# Altium schematic sheet Signal_Conditioning_1.SchDoc
size A4; CompanyName: Technische Hochschule Nürnberg Georg Simon Ohm; Address1: Fürther Straße 250; Address2: 90429 Nürnberg; Address3: GERMANY; SheetNumber: 4; SheetTotal: 5; CompanyName2: Institut ELSYS
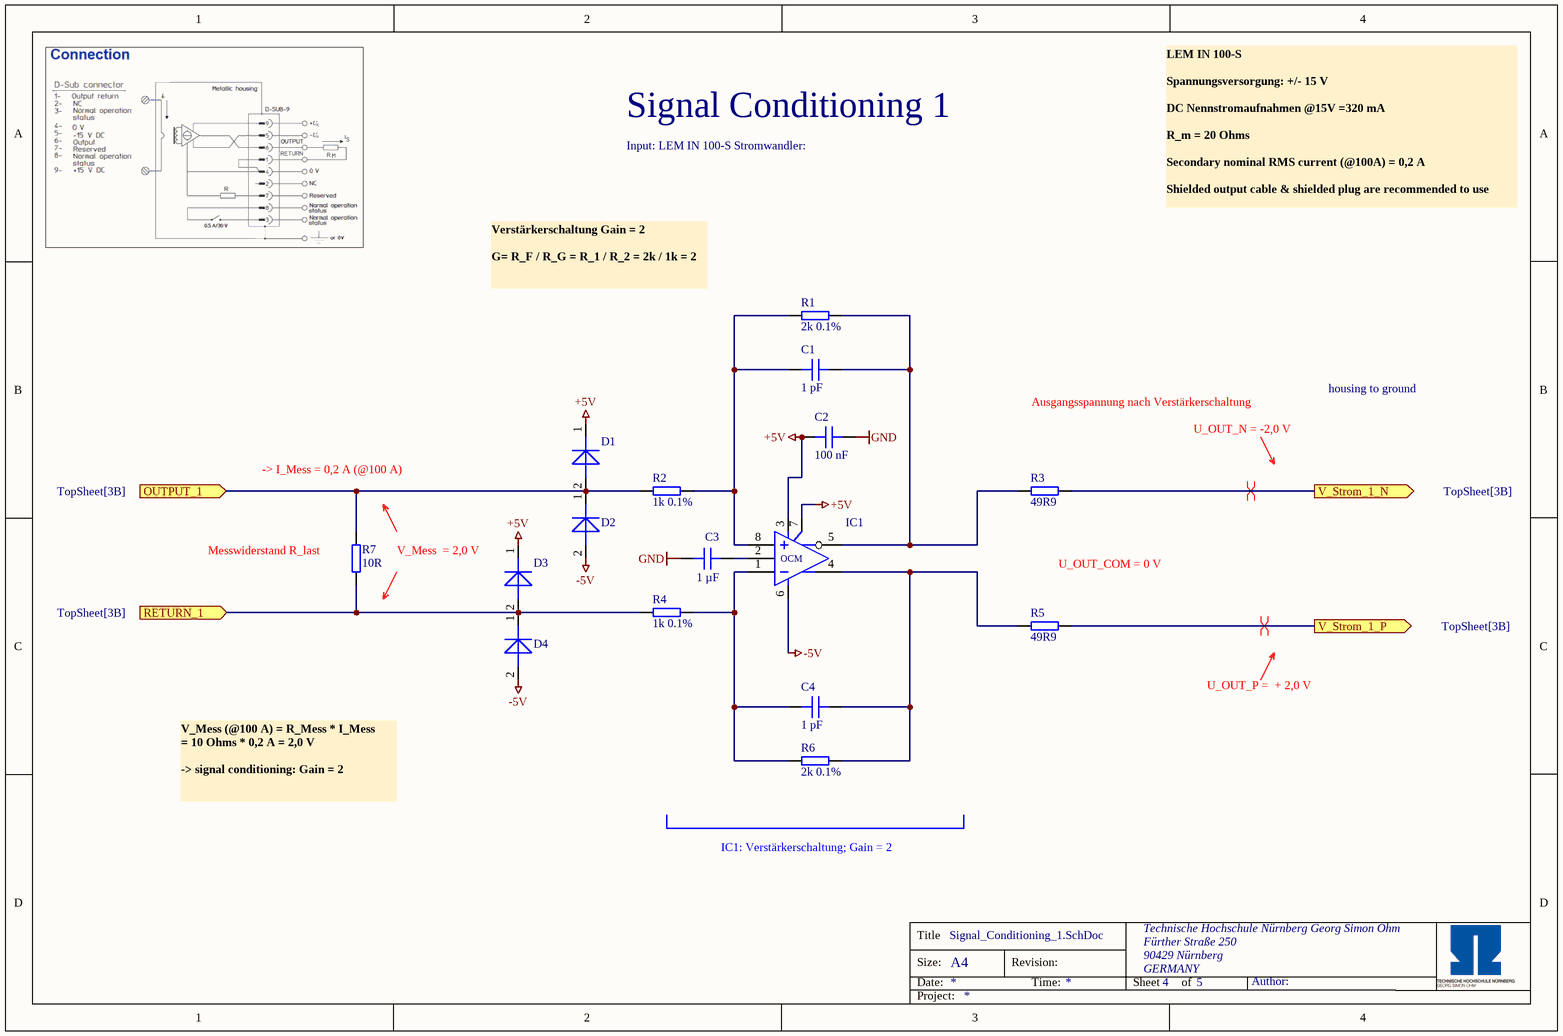
[diagram p0: Signal_Conditioning_1.SchDoc]

## Parts
C1  1 pF  [C_0603]
C2  100 nF  [C_0603]
C3  1 µF  [C_0603]
C4  1 pF  [C_0603]
D1  1SS356VMFHTE-17  [1SS356VMFHTE17]  (value not drawn)
D2  1SS356VMFHTE-17  [1SS356VMFHTE17]  (value not drawn)
D3  1SS356VMFHTE-17  [1SS356VMFHTE17]  (value not drawn)
D4  1SS356VMFHTE-17  [1SS356VMFHTE17]  (value not drawn)
IC1  ADA4940-1ARZ-R7  [SOIC-8-N]  (value not drawn)
R1  2k 0.1%  [RES 1206_3216]
R2  1k 0.1%  [RES 1206_3216]
R3  49R9  [RES 0603_1608]
R4  1k 0.1%  [RES 1206_3216]
R5  49R9  [RES 0603_1608]
R6  2k 0.1%  [RES 1206_3216]
R7  10R  [RES 1206_3216]

## Ports
OUTPUT_1 (in, see TopSheet[3B]), RETURN_1 (in, see TopSheet[3B]), V_Strom_1_N (out, see TopSheet[3B]), V_Strom_1_P (out, see TopSheet[3B])

## Nets
+5V: C2.1 D1.1(K) D3.1(K) IC1.3(V+) IC1.7(EN)
-5V: D2.2(A) D4.2(A) IC1.6(V-)
GND: C2.2 C3.1
OUTPUT_1: D1.2(A) D2.1(K) R2.1 R7.2 ; port OUTPUT_1
RETURN_1: D3.2(A) D4.1(K) R4.1 R7.1 ; port RETURN_1
V_Strom_1_N: R3.2 ; port V_Strom_1_N
V_Strom_1_P: R5.2 ; port V_Strom_1_P
NetC1_1: C1.1 IC1.8(+) R1.1 R2.2
NetC1_2: C1.2 IC1.5(Out) R1.2 R3.1
NetC3_2: C3.2 IC1.2(OCM)
NetC4_1: C4.1 IC1.1(-) R4.2 R6.1
NetC4_2: C4.2 IC1.4(Out) R5.1 R6.2

## Layout directives
differential pair: V_Strom_1_N, V_Strom_1_P

## Notes on the sheet
- Signal Conditioning 1
- Input: LEM IN 100-S Stromwandler:
- LEM IN 100-S
  Spannungsversorgung: +/- 15 V
  DC Nennstromaufnahmen @15V =320 mA
  R_m = 20 Ohms
  Secondary nominal RMS current (@100A) = 0,2 A
  Shielded output cable & shielded plug are recommended to use
- Verstärkerschaltung Gain = 2
  G= R_F / R_G = R_1 / R_2 = 2k / 1k = 2
- Ausgangsspannung nach Verstärkerschaltung
- U_OUT_N = -2,0 V
- housing to ground
- -> I_Mess = 0,2 A (@100 A)
- (near R7) Messwiderstand R_last
- V_Mess  = 2,0 V
- U_OUT_COM = 0 V
- U_OUT_P =  + 2,0 V
- V_Mess (@100 A) = R_Mess * I_Mess
  = 10 Ohms * 0,2 A = 2,0 V
  -> signal conditioning: Gain = 2
- IC1: Verstärkerschaltung; Gain = 2
- Title
- Size:
- Date:
- A4
- Revision:
- Time:
- Sheet
- of
- Author:
- Project:

## Library data of the parts
C1 C4 = KGM15ACG1H1R0BT: Multilayer Ceramic Capacitors MLCC - SMD/SMT 50V 1pF C0G 0603 +/-.1pF; Manufacturer: KYOCERA AVX; Tolerance: 10%; Voltage Rating: 50 VDC; Created from: TGaupp; Manufacturer Part Number: KGM15ACG1H1R0BT; PartID: 147; Created On: 13.02.2024 08:51:22; ComponentLink1Description: Datasheet; ComponentLink1URL: https://www.mouser.de/datasheet/2/40/C0GNP0_KGM-3216332.pdf; Component Type: Capacitor 0603; Device Package: 0603; Last Updated: 13.02.2024 08:51:22; Mounting Type: SMD; Operating Temperature: -55 to +125°C; Series: C0G; Supplier 1: Mouser; Supplier Part Number 1: 581-KGM15ACG1H1R0BT; Type: Capacitor; Value: 1 pF; Live Cycle Status: 1
C2 = C0603C104K9PACTU: Capacitor 0603, 6.3 VDC, 100 nF, X5R; Manufacturer: KEMET; Tolerance: 10 %; Voltage Rating: 6.3 VDC; Created from: MGremer; Manufacturer Part Number: C0603C104K9PACTU; PartID: 70; Created On: 20.12.2020 13:54:13; ComponentLink1Description: Datasheet; ComponentLink1URL: https://www.mouser.de/datasheet/2/212/KEM_C1006_X5R_SMD-1103249.pdf; Component Type: Capacitor 0603; Device Package: 0603; Last Updated: 20.01.2021 13:57:36; Mounting Type: SMD; Operating Temperature: -55 - 85°C; Series: SMD Comm X5R; Supplier 1: Mouser; Supplier Part Number 1: 80-C0603C104K9P; Type: Capacitor; Value: 100 nF; Live Cycle Status: 1; Stock number: not stored
C3 = CL10A105KB8NNNC: 50V 1uF X5R ±10% 0603  Multilayer Ceramic Capacitors MLCC - SMD/SMT ROHS; Manufacturer: Samsung Electro-Mechanics; Voltage Rating: 50 VDC; Created from: MGremer; Supplier 1: LCSC; Supplier Part Number 1: C15849; Manufacturer Part Number: CL10A105KB8NNNC; Value: 1 µF; PartID: 5; Created On: 20.12.2020 13:54:13; ComponentLink1Description: Datasheet; ComponentLink1URL: https://datasheet.lcsc.com/lcsc/1810261812_Samsung-Electro-Mechanics-CL10A105KB8NNNC_C15849.pdf; Component Type: Capacitor 0603; Device Package: 0603; Last Updated: 28.11.2022 17:23:01; Mounting Type: SMD; Operating Temperature: -55 - 85°C; Series: M; Type: Capacitor; Tolerance: 10 %; Live Cycle Status: 1; LCSC Part Number: C15849; Stock number: Labor SMD Container
D1-D4 = 1SS356VMFHTE-17: Diode; Manufacturer_Name: ROHM Semiconductor; Datasheet Link: https://fscdn.rohm.com/en/products/databook/datasheet/discrete/diode/switching/1ss355vmfhte-17-e.pdf; Height: 0.9mm; Manufacturer_Part_Number: 1SS356VMFHTE-17; Mouser Part Number: 755-1SS356VMFHTE-17; Mouser Price/Stock: https://www.mouser.co.uk/ProductDetail/ROHM-Semiconductor/1SS356VMFHTE-17?qs=doiCPypUmgG12xHjyvfQdg%3D%3D; Supplier 1: Mouser; Supplier Part Number 1: 755-1SS356VMFHTE-17
IC1 = ADA4940-1ARZ-R7: Differential ADC Driver; Manufacturer: Analog Devices; Class I: Analog; Class II: Fully Differential ADC Drivers (-40-125°C); Best.-Nr.: Farnell 209-6178; Channels: 1; Created from: MGremer; Datasheet: DSO11449, Ver. Aug 2000; Last edited: 04.01.2007 10:14; Package Reference: SOIC-N-8; Manufacturer Part Number: ADA4940-1ARZ-R7; PartID: 3; Created On: 15.01.2021 12:16:53; ComponentLink1Description: Datasheet; ComponentLink1URL: https://www.mouser.de/datasheet/2/609/ADA4940-1_4940-2-878284.pdf; Component Type: ADC; Device Package: SOIC-8; Last Updated: 22.11.2021 15:19:18; Mounting Type: SMD; Operating Temperature: -40 - 105 °C; Supplier 1: Mouser; Supplier Part Number 1: 584-ADA4940-1ARZ-R7; Type: ADC; Resolution: -; Value: differential ADC driver; Live Cycle Status: 1; Stock number: not stored
R1 R6 = TNPW12062K00BEEA: SMD resistor 2Kohms .1% 400mW 25ppm; Manufacturer: Vishay; Created from: TGaupp; Manufacturer Part Number: TNPW12062K00BEEA; PartID: 323; Created On: 12.02.2024 09:48:36; ComponentLink1Description: Datasheet; ComponentLink1URL: https://www.vishay.com/docs/28758/tnpw_e3.pdf; Component Type: SMD resistor; Device Package: 1206; Last Updated: 12.02.2024 09:48:36; Mounting Type: SMD; Supplier 1: Mouser; Supplier Part Number 1: 71-TNPW12062K00BEEA; Type: Resistor; Tolerance: 0.1%; Value: 2k; Live Cycle Status: 1; Stock number: not stored
R2 R4 = ERA-8AEB102V: SMD resistor 1/4W 1.0Kohm 0.1% 25ppm; Manufacturer: Panasonic; Created from: TGaupp; Manufacturer Part Number: ERA-8AEB102V; PartID: 292; Created On: 08.08.2023 13:03:51; ComponentLink1Description: Datasheet; ComponentLink1URL: https://www.mouser.de/datasheet/2/315/AOA0000C307-1149632.pdf; Component Type: SMD resistor; Device Package: 1206; Last Updated: 08.08.2023 13:03:51; Mounting Type: SMD; Supplier 1: Mouser; Supplier Part Number 1: 667-ERA-8AEB102V; Type: Resistor; Tolerance: 0.1%; Value: 1k; Live Cycle Status: 1; Stock number: not stored; LCSC Part Number: C2079586
R3 R5 = RC0603FR-0749R9L: 100mW Thick Film Resistors ±100ppm/℃ ±1% 49.9Ω 0603 Chip Resistor - Surface Mount ROHS; Manufacturer: YAGEO; Created from: AGeiger; Manufacturer Part Number: RC0603FR-0749R9L; PartID: 277; Created On: 14.06.2023 17:42:26; ComponentLink1Description: Datasheet; ComponentLink1URL: https://datasheet.lcsc.com/lcsc/2304140030_YAGEO-RC0603FR-0749R9L_C114625.pdf; Component Type: SMD resistor; Device Package: 0603; Last Updated: 14.06.2023 17:42:26; Mounting Type: SMD; Type: Resistor; Tolerance: 1%; Value: 49R9; Live Cycle Status: 1; LCSC Part Number: C114625; Supplier 1: Mouser; Supplier Part Number 1: 603-RC0402FR-0749R9L
R7 = SG73G2BTTD10R0D: SMD 10 ohm 0.5% 0.5W; Manufacturer: KOA Speer; Created from: TGaupp; Manufacturer Part Number: SG73G2BTTD10R0D; PartID: 329; Created On: 13.03.2024 10:06:45; ComponentLink1Description: Datasheet; ComponentLink1URL: https://www.koaspeer.com/pdfs/SG73G.pdf; Component Type: SMD resistor; Device Package: 1206; Last Updated: 13.03.2024 10:06:45; Mounting Type: SMD; Supplier 1: Mouser; Supplier Part Number 1: 660-SG73G2BTTD10R0D; Type: Resistor; Tolerance: 0.5%; Value: 10R; Live Cycle Status: 1; Stock number: not stored